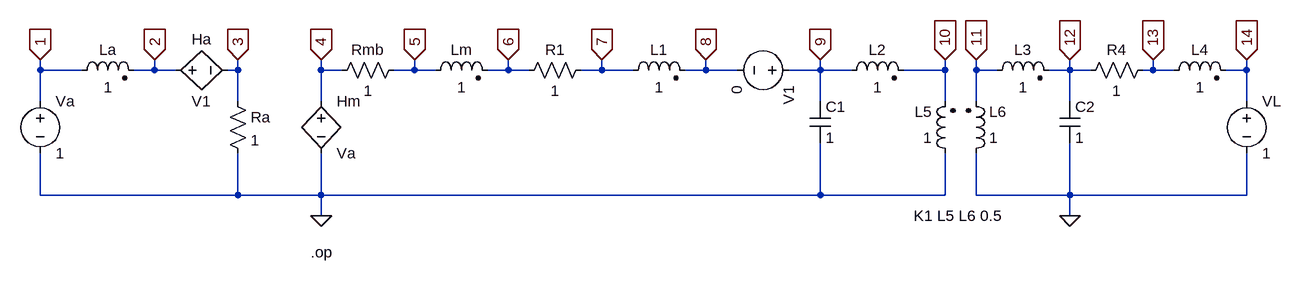
[diagram p0: schematic rotational-mech-sys.asc]
rotational-mech-sys.asc, the LTspice schematic file:
Version 4
SHEET 1 1544 680
WIRE -464 80 -464 64
WIRE -400 80 -464 80
WIRE -288 80 -288 64
WIRE -288 80 -320 80
WIRE -256 80 -288 80
WIRE -160 80 -160 64
WIRE -160 80 -176 80
WIRE -32 80 -32 64
WIRE 0 80 -32 80
WIRE 112 80 112 64
WIRE 112 80 80 80
WIRE 144 80 112 80
WIRE 256 80 256 64
WIRE 256 80 224 80
WIRE 288 80 256 80
WIRE 400 80 400 64
WIRE 400 80 368 80
WIRE 448 80 400 80
WIRE 560 80 560 64
WIRE 560 80 528 80
WIRE 608 80 560 80
WIRE 736 80 736 64
WIRE 736 80 688 80
WIRE 784 80 736 80
WIRE 928 80 928 64
WIRE 928 80 864 80
WIRE 976 80 976 64
WIRE 1008 80 976 80
WIRE 1120 80 1120 64
WIRE 1120 80 1088 80
WIRE 1152 80 1120 80
WIRE 1248 80 1248 64
WIRE 1248 80 1232 80
WIRE 1280 80 1248 80
WIRE 1392 80 1392 64
WIRE 1392 80 1360 80
WIRE -464 128 -464 80
WIRE -160 128 -160 80
WIRE -32 128 -32 80
WIRE 736 128 736 80
WIRE 928 128 928 80
WIRE 976 128 976 80
WIRE 1120 128 1120 80
WIRE 1392 128 1392 80
WIRE -464 272 -464 208
WIRE -160 272 -160 208
WIRE -160 272 -464 272
WIRE -32 272 -32 208
WIRE -32 272 -160 272
WIRE 736 272 736 192
WIRE 736 272 -32 272
WIRE 928 272 928 208
WIRE 928 272 736 272
WIRE 976 272 976 208
WIRE 1120 272 1120 192
WIRE 1120 272 976 272
WIRE 1392 272 1392 208
WIRE 1392 272 1120 272
WIRE -32 304 -32 272
WIRE 1120 304 1120 272
FLAG -32 304 0
FLAG 1120 304 0
FLAG -464 64 1
IOPIN -464 64 In
FLAG -288 64 2
IOPIN -288 64 In
FLAG -160 64 3
IOPIN -160 64 In
FLAG -32 64 4
IOPIN -32 64 In
FLAG 112 64 5
IOPIN 112 64 In
FLAG 256 64 6
IOPIN 256 64 In
FLAG 400 64 7
IOPIN 400 64 In
FLAG 736 64 9
IOPIN 736 64 In
FLAG 928 64 10
IOPIN 928 64 In
FLAG 976 64 11
IOPIN 976 64 In
FLAG 1120 64 12
IOPIN 1120 64 In
FLAG 1248 64 13
IOPIN 1248 64 In
FLAG 1392 64 14
IOPIN 1392 64 In
FLAG 560 64 8
IOPIN 560 64 In
SYMBOL voltage -464 112 R0
WINDOW 123 0 0 Left 0
WINDOW 39 0 0 Left 0
SYMATTR InstName Va
SYMATTR Value 1
SYMBOL voltage 1392 112 R0
WINDOW 123 0 0 Left 0
WINDOW 39 0 0 Left 0
SYMATTR InstName VL
SYMATTR Value 1
SYMBOL ind2 -416 96 R270
WINDOW 0 32 56 VTop 2
WINDOW 3 5 56 VBottom 2
SYMATTR InstName La
SYMATTR Value 1
SYMATTR Type ind
SYMBOL ind2 128 96 R270
WINDOW 0 32 56 VTop 2
WINDOW 3 5 56 VBottom 2
SYMATTR InstName Lm
SYMATTR Value 1
SYMATTR Type ind
SYMBOL ind2 432 96 R270
WINDOW 0 32 56 VTop 2
WINDOW 3 5 56 VBottom 2
SYMATTR InstName L1
SYMATTR Value 1
SYMATTR Type ind
SYMBOL ind2 768 96 R270
WINDOW 0 32 56 VTop 2
WINDOW 3 5 56 VBottom 2
SYMATTR InstName L2
SYMATTR Value 1
SYMATTR Type ind
SYMBOL ind2 944 224 R180
WINDOW 0 36 80 Left 2
WINDOW 3 36 40 Left 2
SYMATTR InstName L5
SYMATTR Value 1
SYMATTR Type ind
SYMBOL ind2 960 224 M180
WINDOW 0 36 80 Left 2
WINDOW 3 36 40 Left 2
SYMATTR InstName L6
SYMATTR Value 1
SYMATTR Type ind
SYMBOL ind2 992 96 R270
WINDOW 0 32 56 VTop 2
WINDOW 3 5 56 VBottom 2
SYMATTR InstName L3
SYMATTR Value 1
SYMATTR Type ind
SYMBOL ind2 1264 96 R270
WINDOW 0 32 56 VTop 2
WINDOW 3 5 56 VBottom 2
SYMATTR InstName L4
SYMATTR Value 1
SYMATTR Type ind
SYMBOL res -176 112 R0
SYMATTR InstName Ra
SYMATTR Value 1
SYMBOL res 96 64 R90
WINDOW 0 0 56 VBottom 2
WINDOW 3 32 56 VTop 2
SYMATTR InstName Rmb
SYMATTR Value 1
SYMBOL res 384 64 R90
WINDOW 0 0 56 VBottom 2
WINDOW 3 32 56 VTop 2
SYMATTR InstName R1
SYMATTR Value 1
SYMBOL res 1248 64 R90
WINDOW 0 0 56 VBottom 2
WINDOW 3 32 56 VTop 2
SYMATTR InstName R4
SYMATTR Value 1
SYMBOL cap 720 128 R0
SYMATTR InstName C1
SYMATTR Value 1
SYMBOL cap 1104 128 R0
SYMATTR InstName C2
SYMATTR Value 1
SYMBOL h -272 80 R270
WINDOW 0 32 56 VTop 2
WINDOW 3 -32 56 VBottom 2
SYMATTR InstName Ha
SYMATTR Value V1
SYMATTR Value2 1
SYMBOL h -32 112 R0
SYMATTR InstName Hm
SYMATTR Value Va
SYMATTR Value2 1
SYMBOL voltage 704 80 R90
WINDOW 123 0 0 Left 0
WINDOW 39 0 0 Left 0
SYMATTR InstName V1
SYMATTR Value 0
TEXT 880 304 Left 2 !K1 L5 L6 0.5
TEXT -48 360 Left 2 !.op

The netlist it stands for:
* rotational-mech-sys.asc
Va 1 0 1
VL 14 0 1
La 1 2 1
Lm 5 6 1
L1 7 8 1
L2 9 10 1
L5 0 10 1
L6 0 11 1
L3 11 12 1
L4 13 14 1
Ra 3 0 1
Rmb 5 4 1
R1 7 6 1
R4 13 12 1
C1 9 0 1
C2 12 0 1
Ha 2 3 V1 1
Hm 4 0 Va 1
V1 9 8 0
K1 L5 L6 0.5
.op
.backanno
.end